# EAGLE design calc1 (EAGLE 5.10)

## Sheet 1 of 4
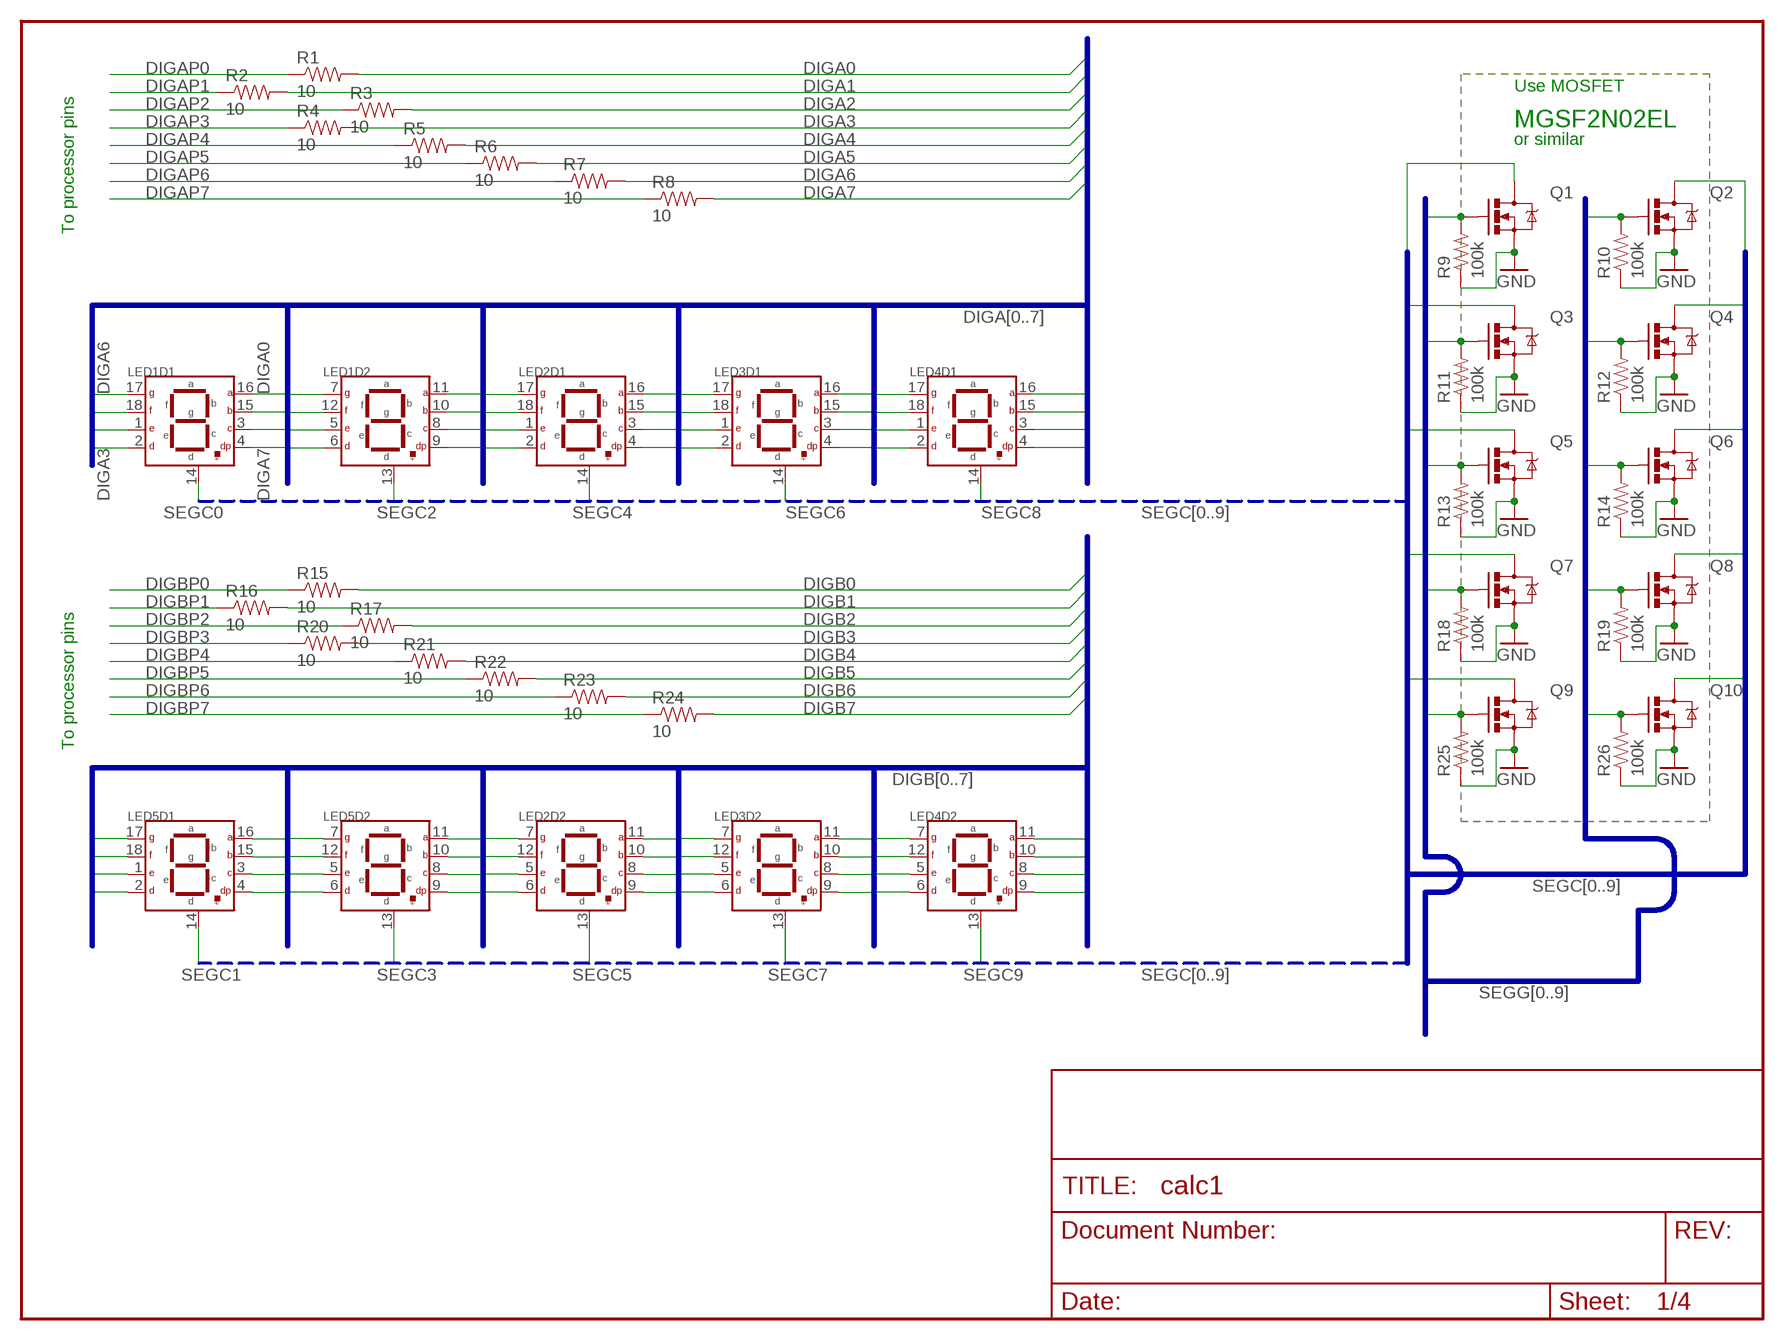
[diagram p0: schematic, sheet 1]

### Parts
LED1  2X7SEGMENT2X  [2X7SEG_PTH]
LED2  2X7SEGMENT2X  [2X7SEG_PTH]
LED3  2X7SEGMENT2X  [2X7SEG_PTH]
LED4  2X7SEGMENT2X  [2X7SEG_PTH]
LED5  2X7SEGMENT2X  [2X7SEG_PTH]
Q1  MOSFET-NCHANNELSMD  [SOT23-3]
Q2  MOSFET-NCHANNELSMD  [SOT23-3]
Q3  MOSFET-NCHANNELSMD  [SOT23-3]
Q4  MOSFET-NCHANNELSMD  [SOT23-3]
Q5  MOSFET-NCHANNELSMD  [SOT23-3]
Q6  MOSFET-NCHANNELSMD  [SOT23-3]
Q7  MOSFET-NCHANNELSMD  [SOT23-3]
Q8  MOSFET-NCHANNELSMD  [SOT23-3]
Q9  MOSFET-NCHANNELSMD  [SOT23-3]
Q10  MOSFET-NCHANNELSMD  [SOT23-3]
R1  10  RESISTOR  [0805]
R2  10  RESISTOR  [0805]
R3  10  RESISTOR  [0805]
R4  10  RESISTOR  [0805]
R5  10  RESISTOR  [0805]
R6  10  RESISTOR  [0805]
R7  10  RESISTOR  [0805]
R8  10  RESISTOR  [0805]
R9  100k  RESISTOR0603  [0603]
R10  100k  RESISTOR0603  [0603]
R11  100k  RESISTOR0603  [0603]
R12  100k  RESISTOR0603  [0603]
R13  100k  RESISTOR0603  [0603]
R14  100k  RESISTOR0603  [0603]
R15  10  RESISTOR  [0805]
R16  10  RESISTOR  [0805]
R17  10  RESISTOR  [0805]
R18  100k  RESISTOR0603  [0603]
R19  100k  RESISTOR0603  [0603]
R20  10  RESISTOR  [0805]
R21  10  RESISTOR  [0805]
R22  10  RESISTOR  [0805]
R23  10  RESISTOR  [0805]
R24  10  RESISTOR  [0805]
R25  100k  RESISTOR0603  [0603]
R26  100k  RESISTOR0603  [0603]

### Nets
DIGA0: LED1.11(D2:A) LED1.16(D1:A) LED2.16(D1:A) LED3.16(D1:A) LED4.16(D1:A) R1.2
DIGA1: LED1.10(D2:B) LED1.15(D1:B) LED2.15(D1:B) LED3.15(D1:B) LED4.15(D1:B) R2.2
DIGA2: LED1.3(D1:C) LED1.8(D2:C) LED2.3(D1:C) LED3.3(D1:C) LED4.3(D1:C) R3.2
DIGA3: LED1.2(D1:D) LED1.6(D2:D) LED2.2(D1:D) LED3.2(D1:D) LED4.2(D1:D) R4.2
DIGA4: LED1.1(D1:E) LED1.5(D2:E) LED2.1(D1:E) LED3.1(D1:E) LED4.1(D1:E) R5.2
DIGA5: LED1.12(D2:F) LED1.18(D1:F) LED2.18(D1:F) LED3.18(D1:F) LED4.18(D1:F) R6.2
DIGA6: LED1.7(D2:G) LED1.17(D1:G) LED2.17(D1:G) LED3.17(D1:G) LED4.17(D1:G) R7.2
DIGA7: LED1.4(D1:DP) LED1.9(D2:DP) LED2.4(D1:DP) LED3.4(D1:DP) LED4.4(D1:DP) R8.2
DIGAP0: R1.1 ; also sheet 2
DIGAP1: R2.1 ; also sheet 2
DIGAP2: R3.1 ; also sheet 2
DIGAP3: R4.1 ; also sheet 2
DIGAP4: R5.1 ; also sheet 2
DIGAP5: R6.1 ; also sheet 2
DIGAP6: R7.1 ; also sheet 2
DIGAP7: R8.1 ; also sheet 2
DIGB0: LED2.11(D2:A) LED3.11(D2:A) LED4.11(D2:A) LED5.11(D2:A) LED5.16(D1:A) R15.2
DIGB1: LED2.10(D2:B) LED3.10(D2:B) LED4.10(D2:B) LED5.10(D2:B) LED5.15(D1:B) R16.2
DIGB2: LED2.8(D2:C) LED3.8(D2:C) LED4.8(D2:C) LED5.3(D1:C) LED5.8(D2:C) R17.2
DIGB3: LED2.6(D2:D) LED3.6(D2:D) LED4.6(D2:D) LED5.2(D1:D) LED5.6(D2:D) R20.2
DIGB4: LED2.5(D2:E) LED3.5(D2:E) LED4.5(D2:E) LED5.1(D1:E) LED5.5(D2:E) R21.2
DIGB5: LED2.12(D2:F) LED3.12(D2:F) LED4.12(D2:F) LED5.12(D2:F) LED5.18(D1:F) R22.2
DIGB6: LED2.7(D2:G) LED3.7(D2:G) LED4.7(D2:G) LED5.7(D2:G) LED5.17(D1:G) R23.2
DIGB7: LED2.9(D2:DP) LED3.9(D2:DP) LED4.9(D2:DP) LED5.4(D1:DP) LED5.9(D2:DP) R24.2
DIGBP0: R15.1 ; also sheet 2
DIGBP1: R16.1 ; also sheet 2
DIGBP2: R17.1 ; also sheet 2
DIGBP3: R20.1 ; also sheet 2
DIGBP4: R21.1 ; also sheet 2
DIGBP5: R22.1 ; also sheet 2
DIGBP6: R23.1 ; also sheet 2
DIGBP7: R24.1 ; also sheet 2
GND: Q1.2(S) Q2.2(S) Q3.2(S) Q4.2(S) Q5.2(S) Q6.2(S) Q7.2(S) Q8.2(S) Q9.2(S) Q10.2(S) R9.1 R10.1 R11.1 R12.1 R13.1 R14.1 R18.1 R19.1 R25.1 R26.1 ; also sheet 2,3,4
SEGC0: LED1.14(D1:CC) Q1.3(D)
SEGC1: LED5.14(D1:CC) Q3.3(D)
SEGC2: LED1.13(D2:CC) Q5.3(D)
SEGC3: LED5.13(D2:CC) Q7.3(D)
SEGC4: LED2.14(D1:CC) Q9.3(D)
SEGC5: LED2.13(D2:CC) Q2.3(D)
SEGC6: LED3.14(D1:CC) Q4.3(D)
SEGC7: LED3.13(D2:CC) Q6.3(D)
SEGC8: LED4.14(D1:CC) Q8.3(D)
SEGC9: LED4.13(D2:CC) Q10.3(D)
SEGG0: Q1.1(G) R9.2 ; also sheet 2
SEGG1: Q3.1(G) R11.2 ; also sheet 2
SEGG2: Q5.1(G) R13.2 ; also sheet 2
SEGG3: Q7.1(G) R18.2 ; also sheet 2
SEGG4: Q9.1(G) R25.2 ; also sheet 2
SEGG5: Q2.1(G) R10.2 ; also sheet 2
SEGG6: Q4.1(G) R12.2 ; also sheet 2
SEGG7: Q6.1(G) R14.2 ; also sheet 2
SEGG8: Q8.1(G) R19.2 ; also sheet 2
SEGG9: Q10.1(G) R26.2 ; also sheet 2

### Buses
DIGA[0..7]
SEGC[0..9]
SEGG[0..9]
DIGB[0..7]

### Notes on the sheet
- Use MOSFET
- MGSF2N02EL
- or similar
- To processor pins
- To processor pins

## Sheet 2 of 4
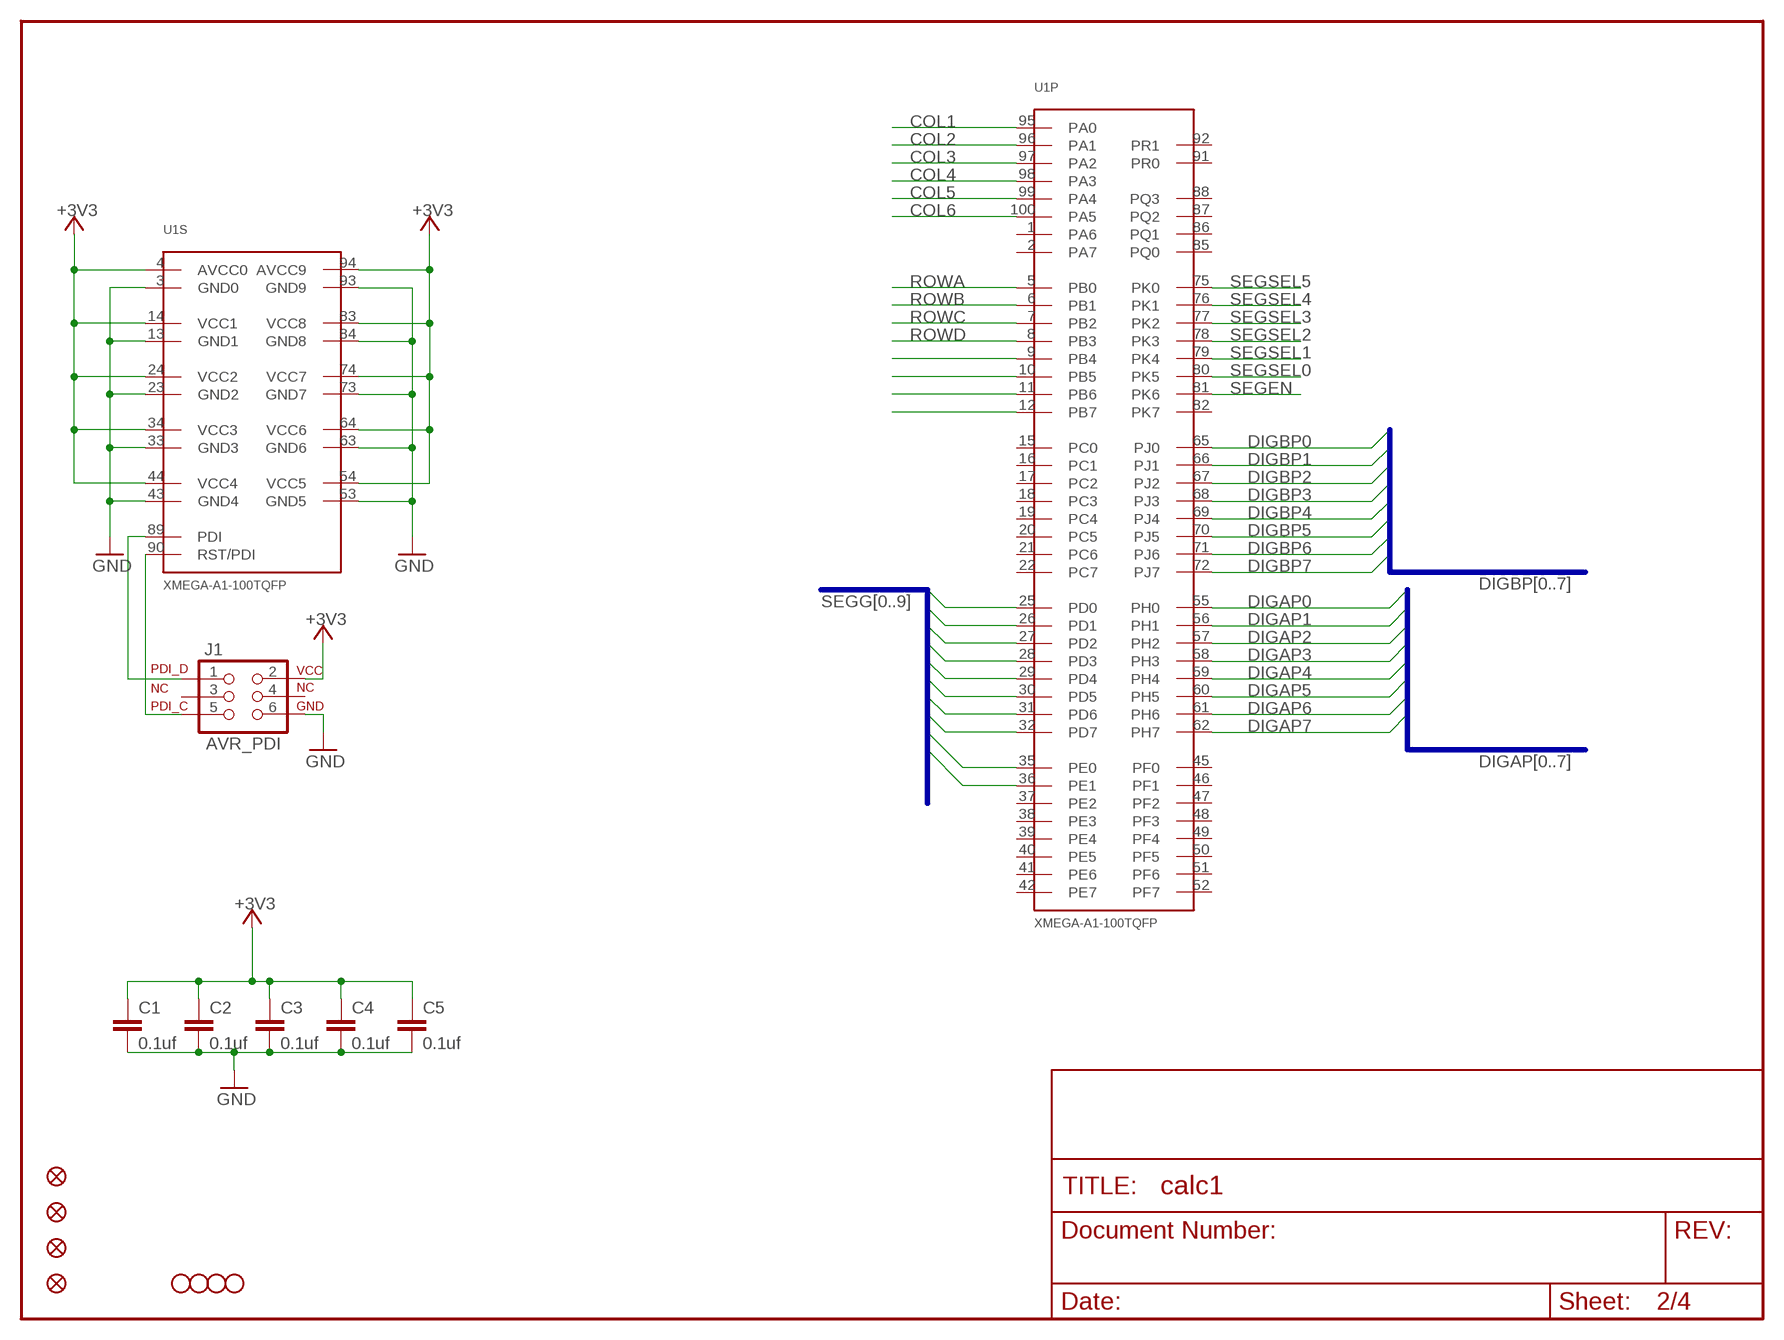
[diagram p1: schematic, sheet 2]

### Parts
$2_80_$  FIDUCIAL1.5X3  [FIDUCIAL-1.5X3]
$2_85_$  STAND-OFF  [STAND-OFF]
C1  0.1uf  CAP0603  [0603]
C2  0.1uf  CAP0603  [0603]
C3  0.1uf  CAP0603  [0603]
C4  0.1uf  CAP0603  [0603]
C5  0.1uf  CAP0603  [0603]
J1  AVR_PDI  [2X3]
U1  XMEGA-A1-100TQFP  [TQFP100]
U$2  FIDUCIAL1.5X3  [FIDUCIAL-1.5X3]
U$3  FIDUCIAL1.5X3  [FIDUCIAL-1.5X3]
U$4  FIDUCIAL1.5X3  [FIDUCIAL-1.5X3]
U$5  STAND-OFF  [STAND-OFF]
U$7  STAND-OFF  [STAND-OFF]
U$8  STAND-OFF  [STAND-OFF]

### Nets
+3V3: C1.1 C2.1 C3.1 C4.1 C5.1 J1.2 U1.4(S:AVCC0) U1.14(S:VCC1) U1.24(S:VCC2) U1.34(S:VCC3) U1.44(S:VCC4) U1.54(S:VCC5) U1.64(S:VCC6) U1.74(S:VCC7) U1.83(S:VCC8) U1.94(S:AVCC9) ; also sheet 3
COL1: U1.95(P:PA0) ; also sheet 4
COL2: U1.96(P:PA1) ; also sheet 4
COL3: U1.97(P:PA2) ; also sheet 4
COL4: U1.98(P:PA3) ; also sheet 4
COL5: U1.99(P:PA4) ; also sheet 4
COL6: U1.100(P:PA5) ; also sheet 4
DIGAP0: U1.55(P:PH0) ; also sheet 1
DIGAP1: U1.56(P:PH1) ; also sheet 1
DIGAP2: U1.57(P:PH2) ; also sheet 1
DIGAP3: U1.58(P:PH3) ; also sheet 1
DIGAP4: U1.59(P:PH4) ; also sheet 1
DIGAP5: U1.60(P:PH5) ; also sheet 1
DIGAP6: U1.61(P:PH6) ; also sheet 1
DIGAP7: U1.62(P:PH7) ; also sheet 1
DIGBP0: U1.65(P:PJ0) ; also sheet 1
DIGBP1: U1.66(P:PJ1) ; also sheet 1
DIGBP2: U1.67(P:PJ2) ; also sheet 1
DIGBP3: U1.68(P:PJ3) ; also sheet 1
DIGBP4: U1.69(P:PJ4) ; also sheet 1
DIGBP5: U1.70(P:PJ5) ; also sheet 1
DIGBP6: U1.71(P:PJ6) ; also sheet 1
DIGBP7: U1.72(P:PJ7) ; also sheet 1
GND: C1.2 C2.2 C3.2 C4.2 C5.2 J1.6 U1.3(S:GND0) U1.13(S:GND1) U1.23(S:GND2) U1.33(S:GND3) U1.43(S:GND4) U1.53(S:GND5) U1.63(S:GND6) U1.73(S:GND7) U1.84(S:GND8) U1.93(S:GND9) ; also sheet 1,3,4
N$1: J1.1 U1.89(S:PDI)
N$2: J1.5 U1.90(S:RST/PDI)
N$13: U1.9(P:PB4)
N$14: U1.10(P:PB5)
N$15: U1.11(P:PB6)
N$16: U1.12(P:PB7)
ROWA: U1.5(P:PB0) ; also sheet 4
ROWB: U1.6(P:PB1) ; also sheet 4
ROWC: U1.7(P:PB2) ; also sheet 4
ROWD: U1.8(P:PB3) ; also sheet 4
SEGEN: U1.81(P:PK6)
SEGG0: U1.25(P:PD0) ; also sheet 1
SEGG1: U1.26(P:PD1) ; also sheet 1
SEGG2: U1.27(P:PD2) ; also sheet 1
SEGG3: U1.28(P:PD3) ; also sheet 1
SEGG4: U1.29(P:PD4) ; also sheet 1
SEGG5: U1.30(P:PD5) ; also sheet 1
SEGG6: U1.31(P:PD6) ; also sheet 1
SEGG7: U1.32(P:PD7) ; also sheet 1
SEGG8: U1.35(P:PE0) ; also sheet 1
SEGG9: U1.36(P:PE1) ; also sheet 1
SEGSEL0: U1.80(P:PK5)
SEGSEL1: U1.79(P:PK4)
SEGSEL2: U1.78(P:PK3)
SEGSEL3: U1.77(P:PK2)
SEGSEL4: U1.76(P:PK1)
SEGSEL5: U1.75(P:PK0)
Unconnected: J1.3 J1.4 U1.1(P:PA6) U1.2(P:PA7) U1.15(P:PC0) U1.16(P:PC1) U1.17(P:PC2) U1.18(P:PC3) U1.19(P:PC4) U1.20(P:PC5) U1.21(P:PC6) U1.22(P:PC7) U1.37(P:PE2) U1.38(P:PE3) U1.39(P:PE4) U1.40(P:PE5) U1.41(P:PE6) U1.42(P:PE7) U1.45(P:PF0) U1.46(P:PF1) U1.47(P:PF2) U1.48(P:PF3) U1.49(P:PF4) U1.50(P:PF5) U1.51(P:PF6) U1.52(P:PF7) U1.82(P:PK7) U1.85(P:PQ0) U1.86(P:PQ1) U1.87(P:PQ2) U1.88(P:PQ3) U1.91(P:PR0) U1.92(P:PR1)

### Buses
DIGAP[0..7]
SEGG[0..9]
DIGBP[0..7]

## Sheet 3 of 4
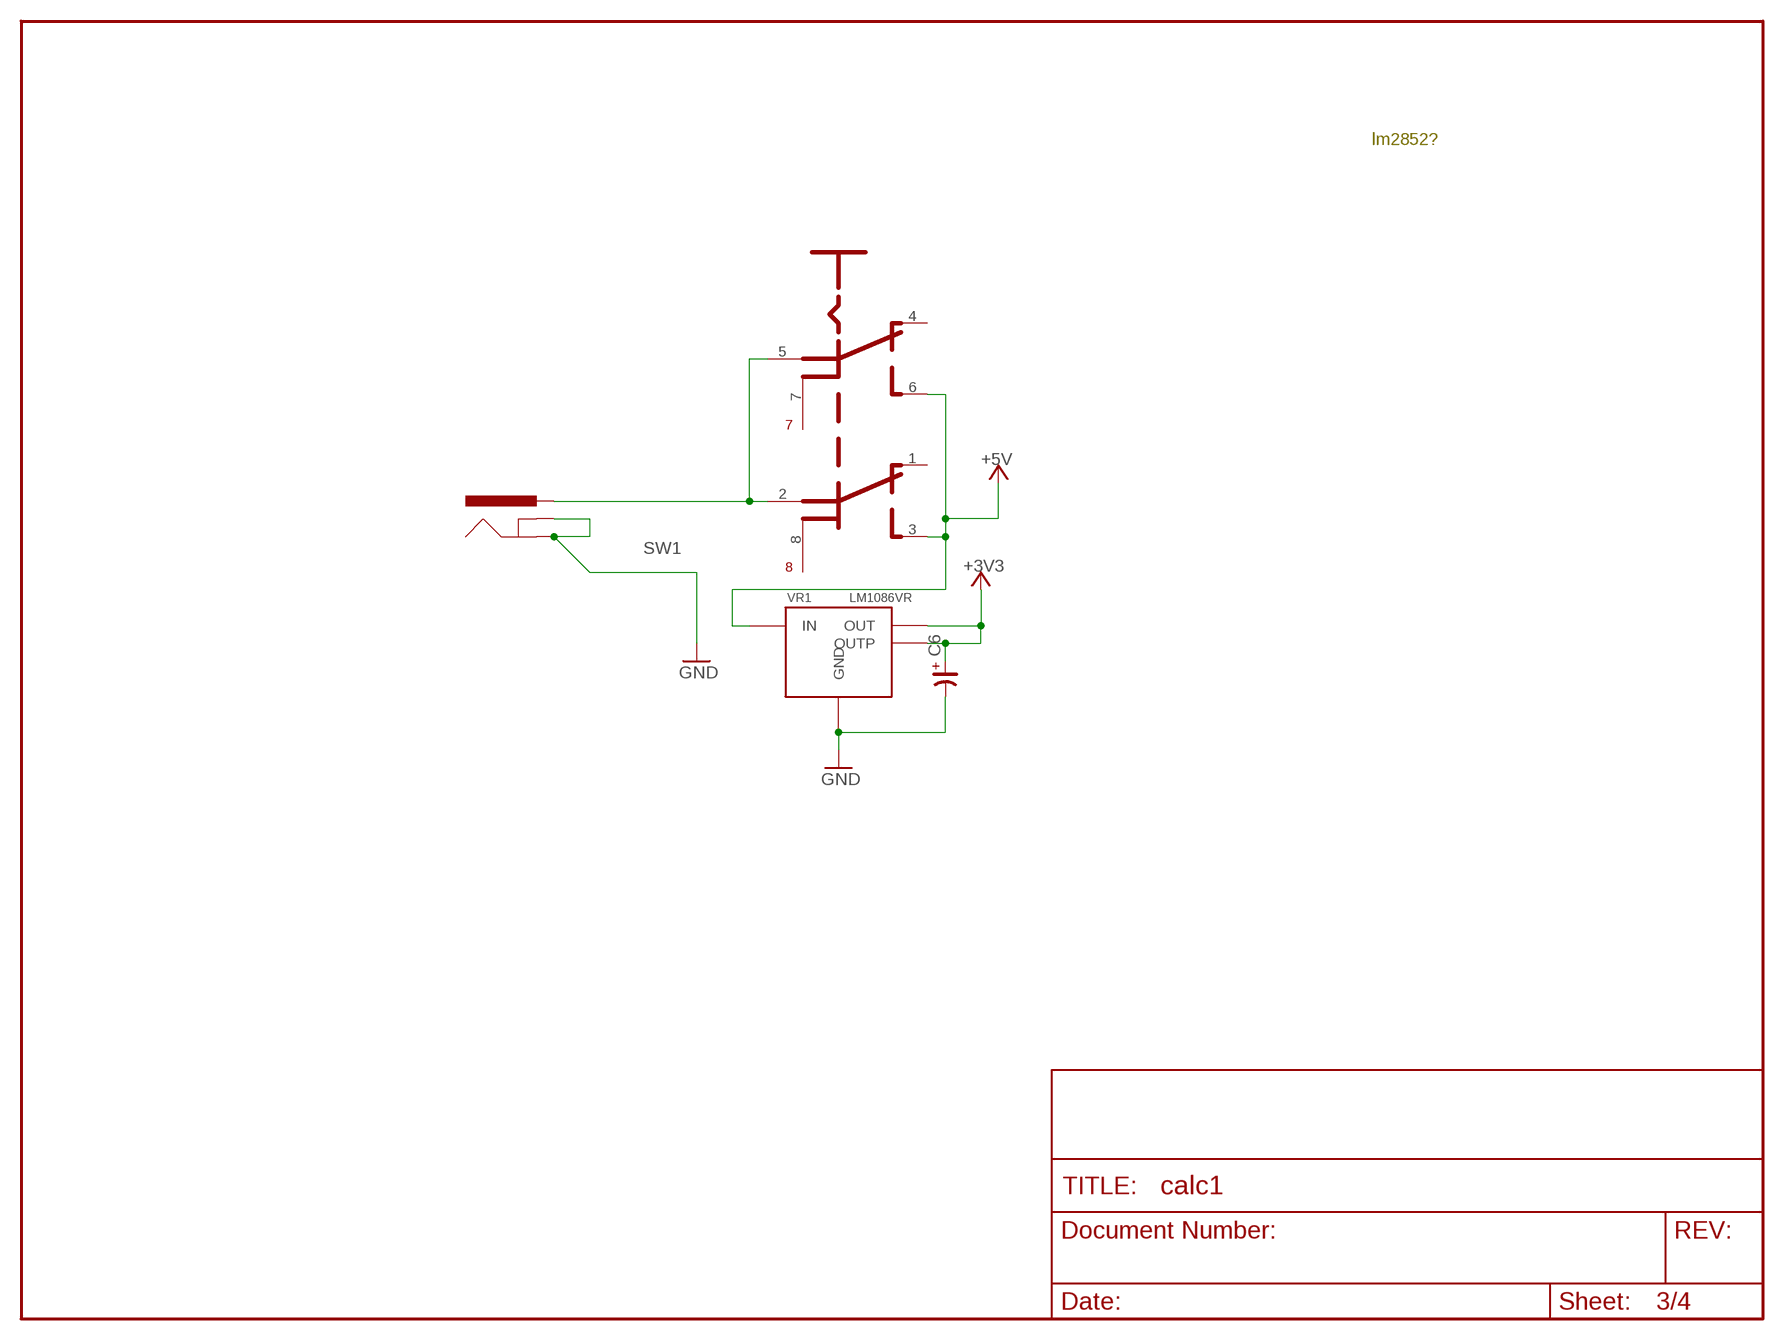
[diagram p2: schematic, sheet 3]

### Parts
C6  CP_SV-D  [CSV-D]
J2  POWER_JACKSLT  [POWER_JACK_SLOT]
SW1  EG2211A  [EG2211A]
VR1  LM1086VR  [TO263]

### Nets
+3V3: C6.+ VR1.2(OUT) VR1.TAB(OUTP) ; also sheet 2
+5V: SW1.3 SW1.6 VR1.3(IN)
GND: C6.- J2.GND@1(GNDBREAK) J2.GND@2(GND) VR1.1(GND) ; also sheet 1,2,4
N$26: J2.PWR SW1.2 SW1.5
Unconnected: SW1.1 SW1.4 SW1.7 SW1.8

### Notes on the sheet
- lm2852?

## Sheet 4 of 4
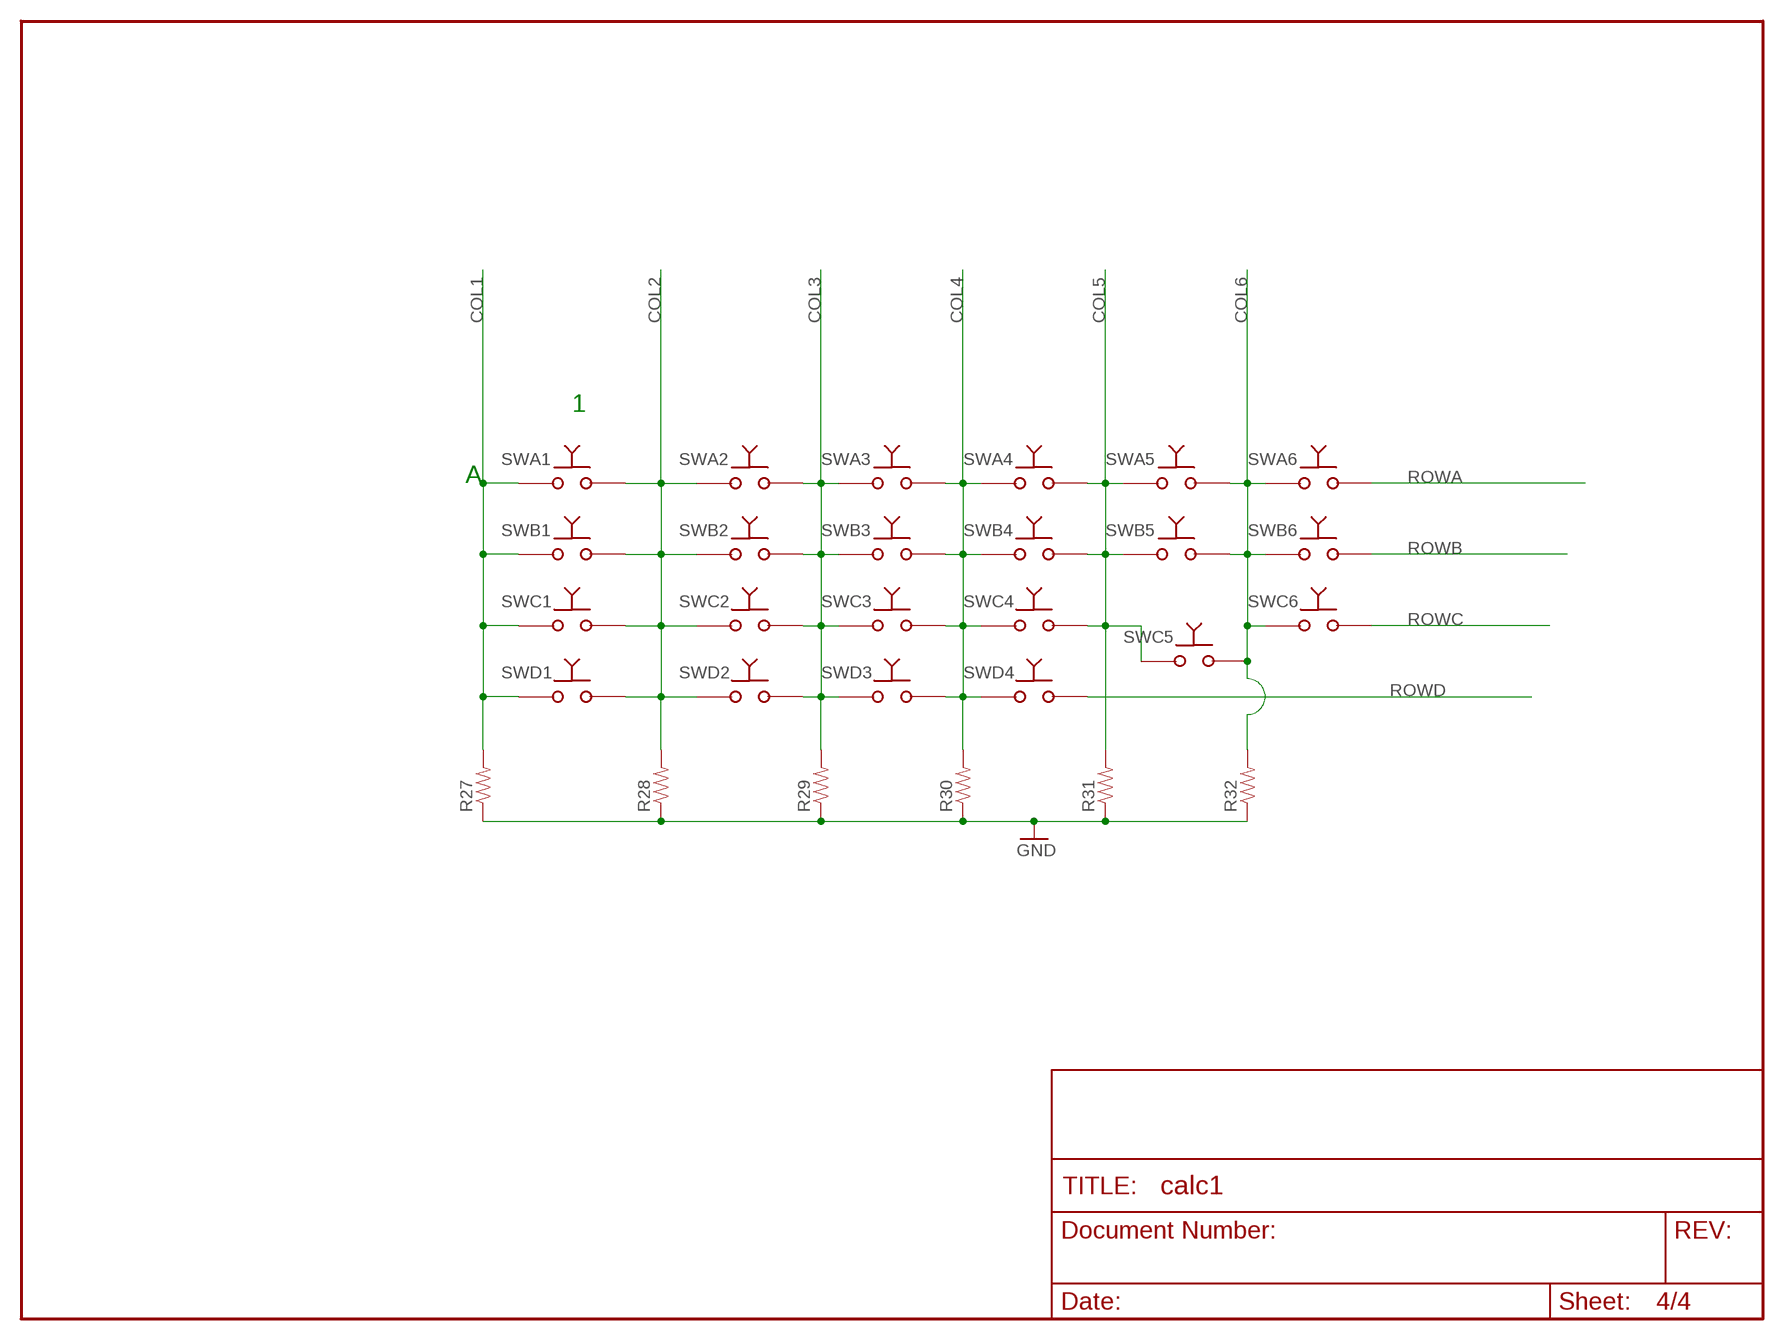
[diagram p3: schematic, sheet 4]

### Parts
R27  RESISTOR0603  [0603]
R28  RESISTOR0603  [0603]
R29  RESISTOR0603  [0603]
R30  RESISTOR0603  [0603]
R31  RESISTOR0603  [0603]
R32  RESISTOR0603  [0603]
SWA1  320E1-1  [320E1-1]
SWA2  320E1-1  [320E1-1]
SWA3  320E1-1  [320E1-1]
SWA4  320E1-1  [320E1-1]
SWA5  320E1-1  [320E1-1]
SWA6  320E1-1  [320E1-1]
SWB1  320E1-1  [320E1-1]
SWB2  320E1-1  [320E1-1]
SWB3  320E1-1  [320E1-1]
SWB4  320E1-1  [320E1-1]
SWB5  320E1-1  [320E1-1]
SWB6  320E1-1  [320E1-1]
SWC1  320E1-1  [320E1-1]
SWC2  320E1-1  [320E1-1]
SWC3  320E1-1  [320E1-1]
SWC4  320E1-1  [320E1-1]
SWC5  320E1-1  [320E1-1]
SWC6  320E1-1  [320E1-1]
SWD1  320E1-1  [320E1-1]
SWD2  320E1-1  [320E1-1]
SWD3  320E1-1  [320E1-1]
SWD4  320E1-1  [320E1-1]

### Nets
COL1: R27.2 SWA1.P$1 SWB1.P$1 SWC1.P$1 SWD1.P$1 ; also sheet 2
COL2: R28.2 SWA1.P$2 SWA2.P$1 SWB1.P$2 SWB2.P$1 SWC1.P$2 SWC2.P$1 SWD1.P$2 SWD2.P$1 ; also sheet 2
COL3: R29.2 SWA2.P$2 SWA3.P$1 SWB2.P$2 SWB3.P$1 SWC2.P$2 SWC3.P$1 SWD2.P$2 SWD3.P$1 ; also sheet 2
COL4: R30.2 SWA3.P$2 SWA4.P$1 SWB3.P$2 SWB4.P$1 SWC3.P$2 SWC4.P$1 SWD3.P$2 SWD4.P$1 ; also sheet 2
COL5: R31.2 SWA4.P$2 SWA5.P$1 SWB4.P$2 SWB5.P$1 SWC4.P$2 SWC5.P$1 ; also sheet 2
COL6: R32.2 SWA5.P$2 SWA6.P$1 SWB5.P$2 SWB6.P$1 SWC5.P$2 SWC6.P$1 ; also sheet 2
GND: R27.1 R28.1 R29.1 R30.1 R31.1 R32.1 ; also sheet 1,2,3
ROWA: SWA6.P$2 ; also sheet 2
ROWB: SWB6.P$2 ; also sheet 2
ROWC: SWC6.P$2 ; also sheet 2
ROWD: SWD4.P$2 ; also sheet 2

### Notes on the sheet
- 1
- A

## Library data of the parts
$2_80_$ U$2-U$4 = SparkFun:FIDUCIAL: Fiducial Alignment Points Various fiducial points for machine vision alignment.
$2_85_$ U$5 U$7 U$8 = SparkFun:STAND-OFF: Stand Off This is the mechanical footprint for a #4 phillips button head screw. Use the keepout ring to avoid running the screw head into surrounding components. SKU : PRT-00447
C1-C5 = SparkFun:CAP: Capacitor Standard 0603 ceramic capacitor, and 0.1" leaded capacitor.
C6 = rc-master-smd:CP_: POLARIZED CAP
J1 = con-headers:AVR_PDI
J2 = SparkFun:POWER_JACK: Power Jack This is the standard 5.5mm barrel jack for power. The PTH is the most common, proven, reliable, footprint. All others are experimental. The Slot footprint only works if the mill layer is transmitted to the PCB fab house so be warned. Spark Fun Electronics SKU : PRT-00119. Mating wall wart : TOL-00298 (and others)
LED1-LED5 = 7segment:2X7SEGMENT
Q1-Q10 = SparkFun:MOSFET-NCHANNEL
R1-R32 = SparkFun:RESISTOR: Resistor Basic schematic elements and footprints for 0603, 1206, and PTH 1/10th watt (small) resistors.
SW1 = Switch DPDT:EG2211A
SWA1-SWA6 SWB1-SWB6 SWC1-SWC6 SWD1-SWD4 = switch:320E1-1
U1 = atmel:XMEGA-A1-100: Atmel XMEGA 100 pin devices, A1 series Supply pins are on a different symbol.
VR1 = LM1086:LM1086

## Board
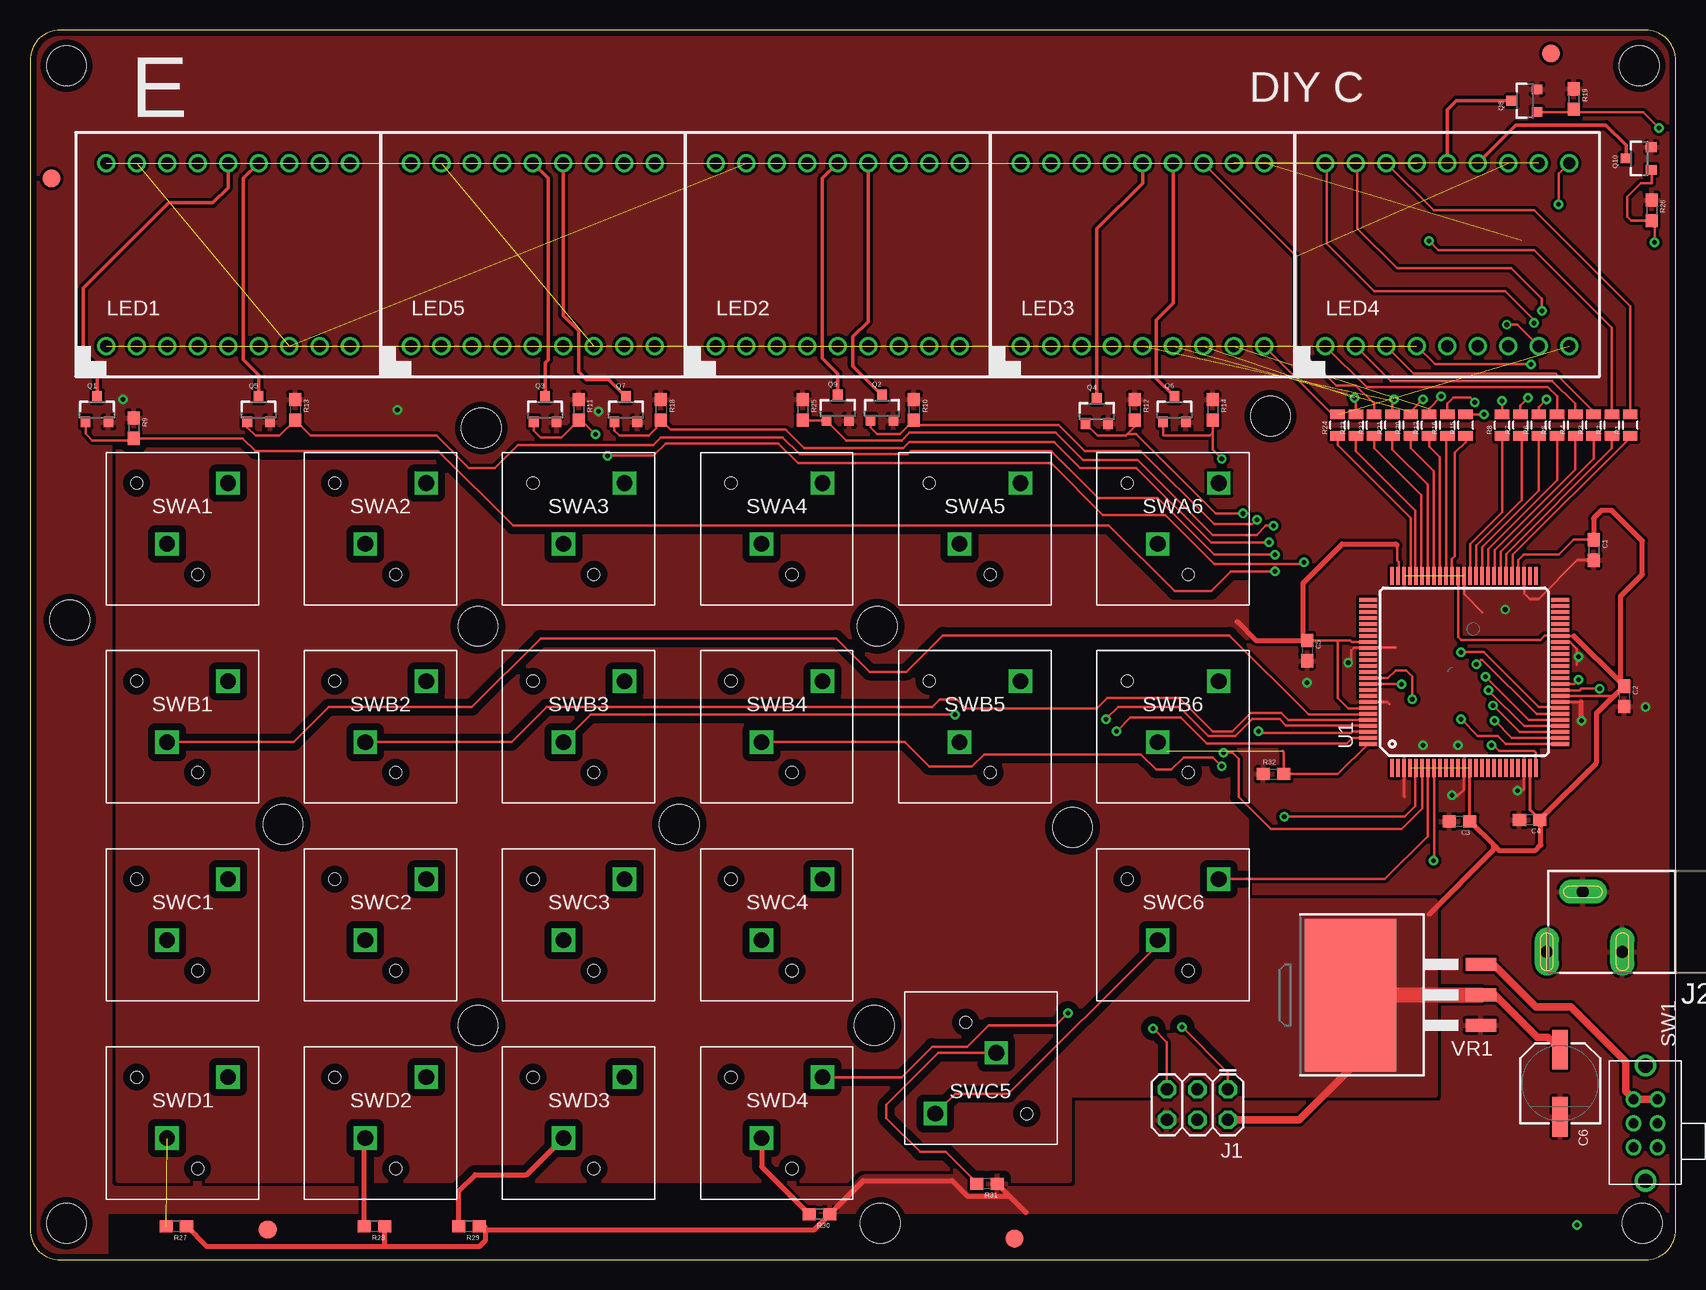
[diagram p4: board, top side]
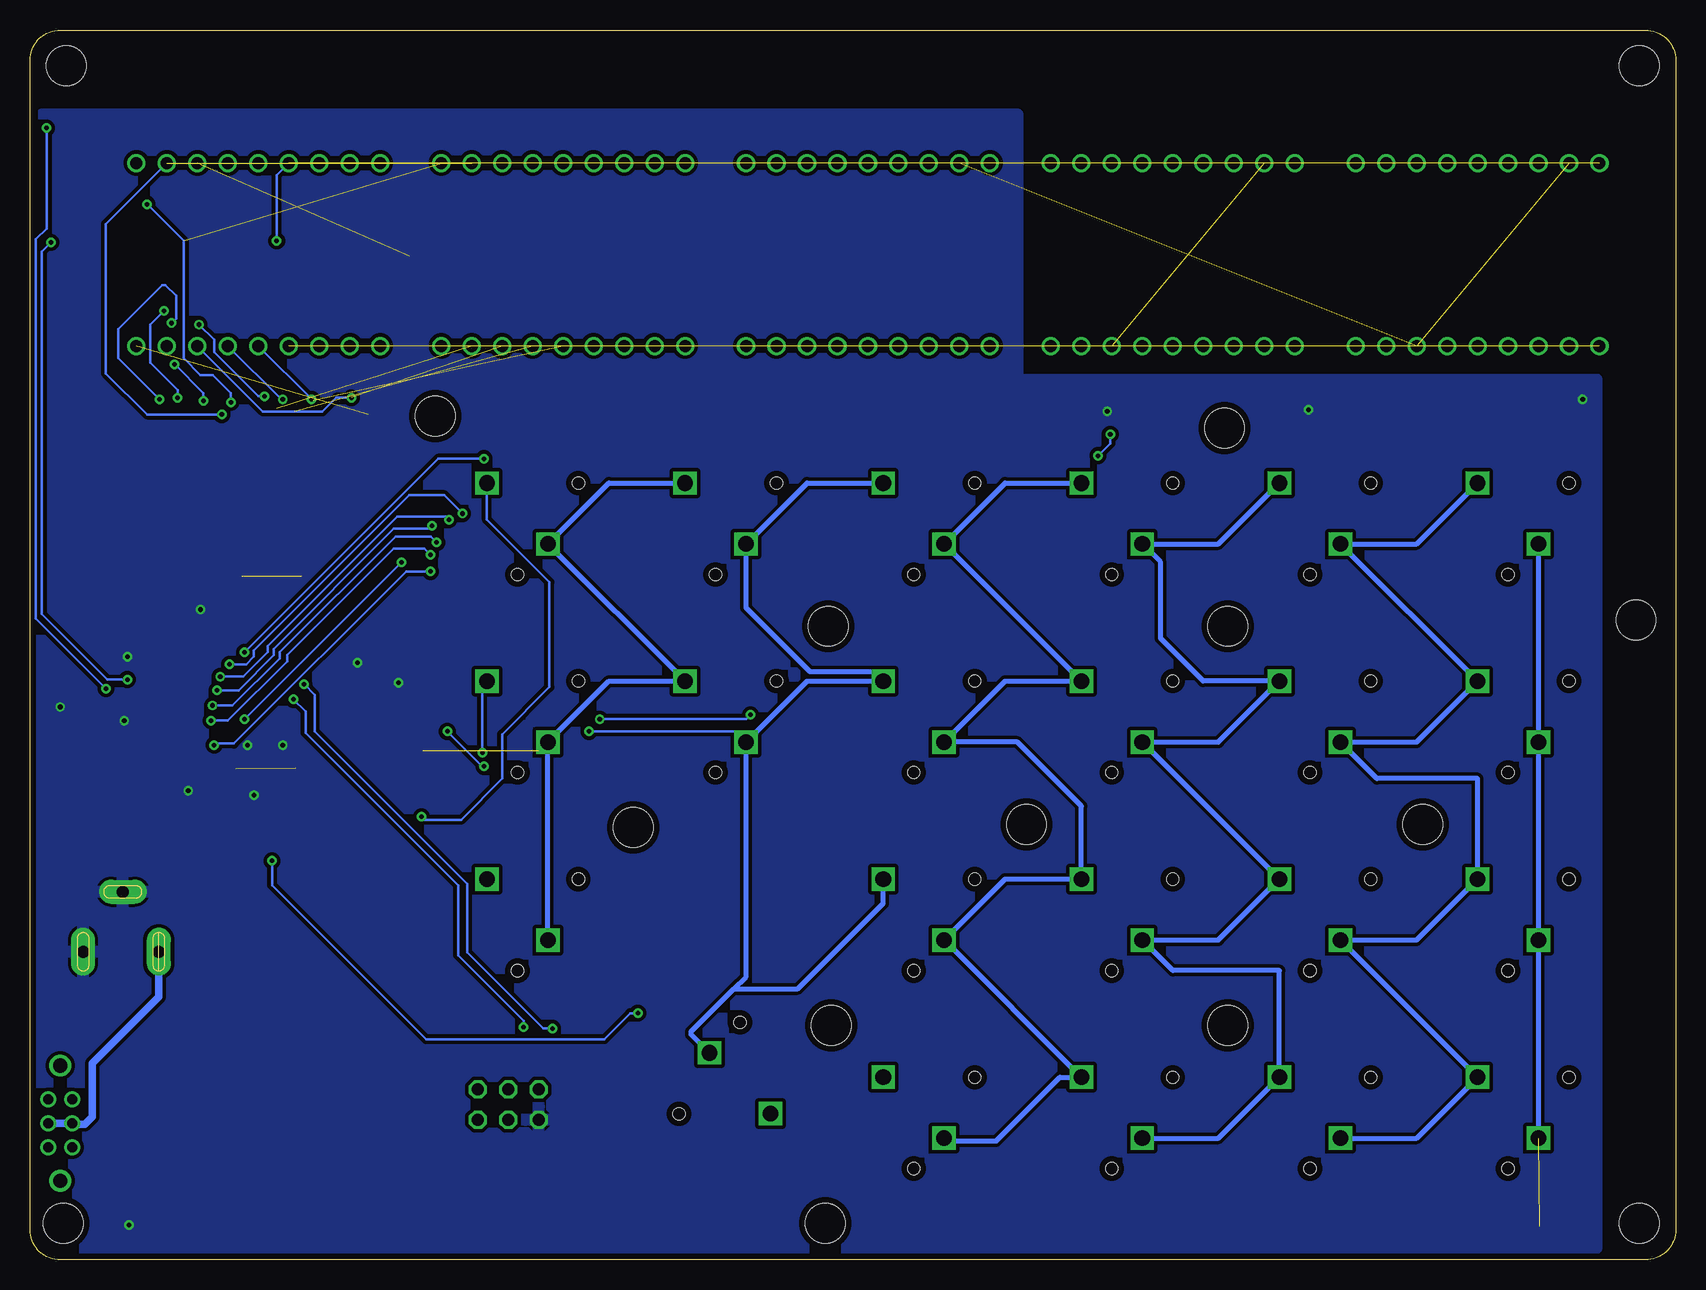
[diagram p5: board, bottom side, seen from below]

Size 137.14 x 102.54 mm. Coordinates in mm from the lower left corner, seen from the top.
Outline: 137.14,100 arc90 134.6,102.54 2.54,102.54 arc90 0,100 0,2.54 arc90 2.54,0 134.6,0 arc90 137.14,2.54 137.14,100
Copper layers (1*16): Top 0.035mm / dielectric 1.5mm / Bottom 0.035mm
Design rules "default *": minimum track width 8mil, minimum drill 15mil, track to track 7mil, track to pad 7mil, pad to pad 7mil, via to via 7mil, smd to smd 7mil, copper to edge 20mil, drill to drill 8mil, minimum pad ring 10mil, minimum via ring 8mil, stop-mask expansion 4mil, vias tented up to drill 15mil, thermal gap 10mil

### Footprints (pad centres in the part's own frame; a part is rotated, then mirrored left to right if it is on the bottom)
FIDUCIAL-1.5X3 = smd 1.5 x 1.5: 1 0,0
STAND-OFF = hole 3.302: 0,0
0603 = smd 1.1 x 1: 1 -0.85,0; 2 0.85,0
CSV-D = smd 3.302 x 1.27: + -2.794,0; - 2.794,0
2X3 = drill 1.016 octagon: 1 0,0; 2 0,2.54; 3 2.54,0; 4 2.54,2.54; 5 5.08,0; 6 5.08,2.54
POWER_JACK_SLOT = drill 1 pad 2 long: GND@1 2.58,7.5; GND@2 7.58,10.8; PWR 2.58,13.8
2X7SEG_PTH = drill 1 round: 1 -10.16,-7.62; 2 -7.62,-7.62; 3 -5.08,-7.62; 4 -2.54,-7.62; 5 0,-7.62; 6 2.54,-7.62; 7 5.08,-7.62; 8 7.62,-7.62; 9 10.16,-7.62; 10 10.16,7.62; 11 7.62,7.62; 12 5.08,7.62; 13 2.54,7.62; 14 0,7.62; 15 -2.54,7.62; 16 -5.08,7.62; 17 -7.62,7.62; 18 -10.16,7.62
SOT23-3 = smd 0.8 x 0.9: 1 -0.95,-1; 2 0.95,-1; 3 0,1.1
0805 = smd 0.8 x 1.2: 1 -0.9,0; 2 0.9,0
EG2211A = drill 0.813 round: 1 2.8,1; 2 4.8,1; 3 6.8,1; 4 2.8,-1; 5 4.8,-1; 6 6.8,-1 | drill 1.2 round: 7 0,0; 8 9.6,0
320E1-1 = drill 1.3 square: P$1 0,0; P$2 5.08,5.08 | hole 1: 2.54,-2.54; -2.54,5.08
TQFP100 = smd 1.5 x 0.3: 1 -8,6; 2 -8,5.5; 3 -8,5; 4 -8,4.5; 5 -8,4; 6 -8,3.5; 7 -8,3; 8 -8,2.5; 9 -8,2; 10 -8,1.5; 11 -8,1; 12 -8,0.5; 13 -8,0; 14 -8,-0.5; 15 -8,-1; 16 -8,-1.5; 17 -8,-2; 18 -8,-2.5; 19 -8,-3; 20 -8,-3.5; 21 -8,-4; 22 -8,-4.5; 23 -8,-5; 24 -8,-5.5; 25 -8,-6; 51 8,-6; 52 8,-5.5; 53 8,-5; 54 8,-4.5; 55 8,-4; 56 8,-3.5; 57 8,-3; 58 8,-2.5; 59 8,-2; 60 8,-1.5; 61 8,-1; 62 8,-0.5; 63 8,0; 64 8,0.5; 65 8,1; 66 8,1.5; 67 8,2; 68 8,2.5; 69 8,3; 70 8,3.5; 71 8,4; 72 8,4.5; 73 8,5; 74 8,5.5; 75 8,6 | smd 0.3 x 1.5: 26 -6,-8; 27 -5.5,-8; 28 -5,-8; 29 -4.5,-8; 30 -4,-8; 31 -3.5,-8; 32 -3,-8; 33 -2.5,-8; 34 -2,-8; 35 -1.5,-8; 36 -1,-8; 37 -0.5,-8; 38 0,-8; 39 0.5,-8; 40 1,-8; 41 1.5,-8; 42 2,-8; 43 2.5,-8; 44 3,-8; 45 3.5,-8; 46 4,-8; 47 4.5,-8; 48 5,-8; 49 5.5,-8; 50 6,-8; 76 6,8; 77 5.5,8; 78 5,8; 79 4.5,8; 80 4,8; 81 3.5,8; 82 3,8; 83 2.5,8; 84 2,8; 85 1.5,8; 86 1,8; 87 0.5,8; 88 0,8; 89 -0.5,8; 90 -1,8; 91 -1.5,8; 92 -2,8; 93 -2.5,8; 94 -3,8; 95 -3.5,8; 96 -4,8; 97 -4.5,8; 98 -5,8; 99 -5.5,8; 100 -6,8
TO263 = smd 1.067 x 2.54: 1 -2.54,-6.6; 2 0,-6.6; 3 2.54,-6.6 | smd 12.7 x 7.62: TAB 0,4.262

### Placement (x,y rotation side)
$2_80_$  1.78,90.17 0 top
$2_85_$  134.37,3.05 0 top
C1  130.3,59.18 270 top
C2  132.84,46.99 270 top
C3  119.13,36.58 180 top
C4  124.97,36.7 180 top
C5  106.43,50.8 270 top
C6  127.51,14.73 270 top
J1  99.82,14.22 180 top
J2  140.21,23.11 90 top
LED1  16.51,83.82 0 top
LED2  67.31,83.82 0 top
LED3  92.71,83.82 0 top
LED4  118.11,83.82 0 top
LED5  41.91,83.82 0 top
Q1  5.59,70.87 0 top
Q2  70.99,70.99 0 top
Q3  42.93,70.87 0 top
Q4  88.9,70.74 0 top
Q5  19.05,70.87 0 top
Q6  95.38,70.87 0 top
Q7  49.66,70.87 0 top
Q8  124.59,96.65 90 top
Q9  67.31,70.99 0 top
Q10  134.11,91.82 90 top
R1  133.35,69.6 90 top
R2  131.83,69.6 90 top
R3  130.3,69.6 90 top
R4  128.78,69.6 90 top
R5  127.25,69.6 90 top
R6  125.73,69.6 90 top
R7  124.21,69.6 90 top
R8  122.68,69.6 90 top
R9  8.64,69.34 270 top
R10  73.66,70.87 270 top
R11  45.72,70.87 270 top
R12  92.07,70.87 270 top
R13  22.1,70.87 270 top
R14  98.55,70.87 270 top
R15  119.63,69.6 90 top
R16  118.11,69.6 90 top
R17  116.59,69.6 90 top
R18  52.58,70.87 270 top
R19  128.65,96.77 270 top
R20  115.06,69.6 90 top
R21  113.54,69.6 90 top
R22  112.01,69.6 90 top
R23  110.49,69.6 90 top
R24  108.97,69.6 90 top
R25  64.39,70.87 270 top
R26  135.13,87.5 270 top
R27  12.19,2.79 180 top
R28  28.7,2.79 180 top
R29  36.58,2.79 180 top
R30  65.79,3.81 180 top
R31  79.76,6.35 180 top
R32  103.63,40.51 0 top
SW1  134.62,6.6 90 top
SWA1  11.43,59.69 0 top
SWA2  27.94,59.69 0 top
SWA3  44.45,59.69 0 top
SWA4  60.96,59.69 0 top
SWA5  77.47,59.69 0 top
SWA6  93.98,59.69 0 top
SWB1  11.43,43.18 0 top
SWB2  27.94,43.18 0 top
SWB3  44.45,43.18 0 top
SWB4  60.96,43.18 0 top
SWB5  77.47,43.18 0 top
SWB6  93.98,43.18 0 top
SWC1  11.43,26.67 0 top
SWC2  27.94,26.67 0 top
SWC3  44.45,26.67 0 top
SWC4  60.96,26.67 0 top
SWC5  80.52,17.27 180 top
SWC6  93.98,26.67 0 top
SWD1  11.43,10.16 0 top
SWD2  27.94,10.16 0 top
SWD3  44.45,10.16 0 top
SWD4  60.96,10.16 0 top
U1  119.51,49.02 90 top
U$1  STAND-OFF  [STAND-OFF]  37.34,19.56 0 top
U$2  126.75,100.58 0 top
U$3  82.04,1.78 0 top
U$4  19.81,2.54 0 top
U$5  3.3,53.34 0 top
U$6  STAND-OFF  [STAND-OFF]  3.05,3.05 0 top
U$7  3.05,99.57 0 top
U$8  134.11,99.57 0 top
U$10  STAND-OFF  [STAND-OFF]  70.87,3.05 0 top
U$11  STAND-OFF  [STAND-OFF]  54.1,36.32 0 top
U$12  STAND-OFF  [STAND-OFF]  21.08,36.32 0 top
U$13  STAND-OFF  [STAND-OFF]  70.61,52.83 0 top
U$15  STAND-OFF  [STAND-OFF]  103.38,70.36 0 top
U$16  STAND-OFF  [STAND-OFF]  37.59,69.34 0 top
U$17  STAND-OFF  [STAND-OFF]  86.87,36.07 0 top
U$18  STAND-OFF  [STAND-OFF]  37.34,52.83 0 top
U$19  STAND-OFF  [STAND-OFF]  70.36,19.56 0 top
VR1  114.3,22.1 90 top

### Tracks (layer width: path | path; a pad name or v marks a point on that pad's centre or on a via)
+3V3  (1 unrouted)
  Top 0.203: U1.54 124.01,58.35 124.46,58.8 127.38,58.8 128.65,60.07 130.26,60.07 C1.1 | 132.02,47.02 U1.34 | 128.66,52.02 U1.44 127.46,52.07 126.24,52.07 125.86,51.69 119.25,51.69 119.01,51.93 U1.64 | C5.1 108.97,51.65 | 108.97,51.65 110.02,51.65 110.15,51.52 U1.83 | 108.97,51.65 108.97,46.86 109.85,45.97 111.46,45.97 U1.94 | 113.92,59.56 113.92,58.29 114.05,58.17 114.05,57.06 U1.74
  Top 0.254: C3.1 119.98,40.99 U1.14 | U1.24 125.01,37.51 C4.1
  Top 0.406: 132.56,48.12 C2.1 132.02,47.02 131.99,47.02 130.56,45.59 130.56,41.44 125.91,36.79 | 132.56,48.12 128.66,52.02 | 125.91,36.79 C4.1 | 125.91,36.79 125.91,34.59 125.48,34.16 122.39,34.16 121.97,34.58 | 121.97,34.58 C3.1 | 106.09,51.65 102.15,51.65 100.58,53.21 | 106.09,51.65 C5.1 | 106.09,51.65 106.09,56.43 109.35,59.69 113.79,59.69 113.92,59.56 | 121.97,34.58 121.97,34.21 116.59,28.83 | 132.56,48.12 132.56,55.34 134.37,57.15 134.37,59.94 131.83,62.48 130.94,62.48 130.3,61.85 C1.1
  Top 0.61: VR1.2 122.05,22.1 125.6,18.54 126.49,18.54 C6.+ | J1.2 105.79,11.68 110.49,16.38 110.49,21.65 VR1.TAB
  Top 1.27: VR1.TAB VR1.2
  pour Top (isolate 0.61, no thermals): 115.06,13.72 86.61,13.72 86.61,6.6 7.37,6.6 7.37,69.09 101.35,69.09 101.35,29.97 117.09,29.97 117.09,13.72
+5V
  Top 0.61: VR1.3 121.92,24.64 125.48,21.08 128.4,21.08 132.97,16.51 132.97,14.05 SW1.3 SW1.6
COL1  (1 unrouted)
  Top 0.203: SWB1.P$1 21.97,43.18 24.89,46.1 36.83,46.1 42.55,51.82 67.18,51.82 69.98,49.02 73.02,49.02 76.07,52.07 99.95,52.07 106.55,45.47 111.45,45.47 U1.95
  Bottom 0.406: SWA1.P$1 SWB1.P$1 SWC1.P$1 SWD1.P$1
COL2
  Top 0.203: U1.96 104.84,45.02 104.27,45.59 101.73,45.59 100.2,44.07 98.55,44.07 95.76,46.86 89.79,46.86 88.9,45.97 77.98,45.97 77.22,46.74 75.82,46.74 75.18,46.1 43.05,46.1 40.13,43.18 SWB2.P$1
  Top 0.406: R28.2 27.85,10.07 SWD2.P$1
  Bottom 0.406: SWA1.P$2 21.59,59.69 SWA2.P$1 SWB1.P$2 21.59,43.18 SWB2.P$1 24.89,40.13 16.51,40.13 SWC1.P$2 21.59,26.67 SWC2.P$1 SWD1.P$2 21.59,10.16 SWD2.P$1
COL3  (via drill 0.38)
  Top 0.203: v89.66,45.09 90.68,46.1 95.76,46.1 98.17,43.69 100.46,43.69 101.85,45.09 104.14,45.09 104.65,44.58 111.45,44.58 U1.97 | v77.09,45.47 46.74,45.47 SWB3.P$1
  Top 0.406: R29.2 35.73,5.75 37.08,7.11 41.4,7.11 SWD3.P$1
  Bottom 0.203: v89.66,45.09 77.47,45.09 v77.09,45.47
  Bottom 0.406: SWD3.P$1 38.1,10.16 SWD2.P$2 33.02,24.13 41.91,24.13 SWC3.P$1 38.1,26.67 SWC2.P$2 SWB3.P$1 38.1,43.18 SWB2.P$2 39.37,48.26 42.93,51.82 42.93,58.17 SWA3.P$1 38.1,59.69 SWA2.P$2
COL4  (via drill 0.38)
  Top 0.203: SWB4.P$1 72.9,43.18 74.93,41.15 78.49,41.15 79.5,42.16 92.58,42.16 93.85,40.89 95.12,40.89 96.14,41.91 98.55,41.91 v99.31,41.15 | 102.41,44.02 v102.36,44.07 102.49,43.94 110.11,43.94 110.24,44.07 111.46,44.07 U1.98
  Top 0.406: SWD4.P$1 60.96,7.79 R30.2
  Bottom 0.203: v99.31,41.15 99.44,41.15 v102.36,44.07
  Bottom 0.406: SWA3.P$2 55.88,64.77 SWA4.P$1 SWB3.P$2 55.88,48.26 SWB4.P$1 54.86,43.18 49.53,37.85 SWC3.P$2 55.88,31.75 SWC4.P$1 SWD3.P$2 51.31,15.24 56.64,9.91 60.71,9.91 SWD4.P$1
COL5  (via drill 0.38)
  Top 0.203: v90.55,44.07 91.69,45.21 95.88,45.21 98.04,43.05 109.73,43.05 110.2,43.52 U1.99 | R31.2 78.91,6.44 76.33,9.02 74.17,9.02 71.37,11.81 71.37,12.95 75.69,17.27 SWC5.P$1
  Bottom 0.203: v90.55,44.07 78.36,44.07 SWB5.P$1
  Bottom 0.406: SWA4.P$2 72.39,64.77 SWA5.P$1 77.47,54.36 72.14,49.02 66.8,49.02 SWB4.P$2 72.39,48.26 SWB5.P$1 77.47,23.62 78.49,22.61 | SWC5.P$1 82.04,18.8 82.04,19.05 78.49,22.61 | SWC4.P$2 66.04,29.72 73.15,22.61 78.49,22.61
COL6  (1 unrouted)
  Top 0.203: U1.100 109,40.51 R32.2 104.48,42.33 104.39,42.42 | SWB6.P$1 94.74,42.42 | SWC6.P$1 93.98,26.29 81.53,13.84 77.09,13.84 SWC5.P$2
  Bottom 0.406: SWA5.P$2 88.9,64.77 SWA6.P$1 SWB5.P$2 88.9,48.26 SWB6.P$1 SWC6.P$1
DIGA0  (4 unrouted)
  Top 0.203: R1.2 133.35,79.5 125.35,87.5 116.97,87.5 LED4.16
DIGA1  (via drill 0.38)  (4 unrouted)
  Top 0.203: R2.2 131.83,77.72 125.35,84.2 117.35,84.2 v116.59,84.96
  Bottom 0.203: v116.59,84.96 116.59,90.42 LED4.15
DIGA2  (4 unrouted)
  Top 0.203: R3.2 130.3,70.74 127.13,73.91 115.32,73.91 LED4.3
DIGA3  (4 unrouted)
  Top 0.203: R4.2 128.78,71.37 126.87,73.28 113.41,73.28 LED4.2
DIGA4  (4 unrouted)
  Top 0.203: R5.2 127.25,72.01 126.49,72.77 111.38,72.77 LED4.1
DIGA5  (via drill 0.38)  (4 unrouted)
  Top 0.203: R6.2 125.73,71.12 v126.36,71.75 | v125.35,78.1 125.35,78.36 122.94,80.77 112.01,80.77 108.08,84.71 108.08,91.31 LED4.18
  Bottom 0.203: v126.36,71.75 129.79,75.18 129.79,77.6 126.11,81.28 125.86,81.28 124.97,80.39 124.97,78.49 v125.35,78.1
DIGA6  (via drill 0.38)  (4 unrouted)
  Top 0.203: R7.2 124.21,71.25 v124.84,71.88 | v125.98,79.12 125.98,80.14 123.44,82.68 113.92,82.68 110.62,85.98 110.62,91.31 LED4.17
  Bottom 0.203: v124.84,71.88 124.84,72.52 127.13,74.8 127.13,77.98 v125.98,79.12
DIGA7  (via drill 0.38)  (4 unrouted)
  Top 0.203: R8.2 v122.68,71.63 | v125.09,74.68 117.09,74.68 LED4.4
  Bottom 0.203: v125.09,74.68 122.68,72.26 v122.68,71.63
DIGAP0
  Top 0.203: U1.55 123.57,57.09 123.57,58.8 133.35,68.58 R1.1
DIGAP1
  Top 0.203: 131.95,68.57 R2.1 131.83,67.69 123.01,58.87 U1.56
DIGAP2
  Top 0.203: R3.1 130.3,66.8 122.55,59.05 122.55,57.07 U1.57
DIGAP3
  Top 0.203: R4.1 128.78,65.91 122.05,59.18 122.05,57.06 U1.58
DIGAP4
  Top 0.203: U1.59 121.51,59.28 127.25,65.02 R5.1
DIGAP5
  Top 0.203: R6.1 125.73,64.13 121.03,59.44 121.03,57.05 U1.60
DIGAP6
  Top 0.203: U1.61 120.51,59.55 124.33,63.37 124.33,68.57 R7.1
DIGAP7
  Top 0.203: R8.1 122.68,62.36 120.02,59.69 U1.62
DIGB0  (via drill 0.38)  (4 unrouted)
  Top 0.203: R15.2 120.66,70.5 v121.16,70.49
  Bottom 0.203: v121.16,70.49 127.38,70.49 130.81,73.91 130.81,86.36 LED4.11
DIGB1  (via drill 0.38)  (4 unrouted)
  Top 0.203: R16.2 118.11,71.37 118.62,71.88 120.02,71.88 v120.4,71.5 | v127.38,88.01 127.38,90.55 LED4.10
  Bottom 0.203: v120.4,71.5 120.4,72.26 121.92,73.79 122.94,73.79 124.33,75.18 124.33,84.96 v127.38,88.01
DIGB2  (via drill 0.38)  (4 unrouted)
  Top 0.203: R17.2 116.59,70.99 v117.6,72.01 | v123.06,77.98 123.95,77.98 LED4.8
  Bottom 0.203: v117.6,72.01 118.11,72.01 121.79,75.69 121.79,76.71 v123.06,77.98
DIGB3  (via drill 0.38)  (4 unrouted)
  Top 0.203: R20.2 115.06,70.74 v116.08,71.75
  Bottom 0.203: v116.08,71.75 116.2,71.75 LED4.6
DIGB4  (via drill 0.38)  (4 unrouted)
  Top 0.203: R21.2 113.54,71.63 v113.67,71.75
  Bottom 0.203: v113.67,71.75 LED4.5
DIGB5  (4 unrouted)
  Top 0.203: R22.2 112.01,71.37 110.49,72.9 108.84,72.9 105.54,76.2 105.54,83.69 LED3.12
DIGB6  (via drill 0.38)  (4 unrouted)
  Top 0.203: R23.2 110.49,71.75 v110.36,71.88
  Bottom 0.203: v110.36,71.88 111.63,71.88 112.78,70.74 117.73,70.74 LED4.7
DIGB7  (4 unrouted)
  Top 0.203: R24.2 108.57,70.5 LED3.9
DIGBP0
  Top 0.203: R15.1 119.63,68.2 118.74,67.31 118.74,58.67 118.49,58.42 118.49,57.04 U1.65
DIGBP1
  Top 0.203: U1.66 118.01,68.59 R16.1
DIGBP2
  Top 0.203: R17.1 116.59,67.82 117.48,66.93 117.48,57.05 U1.67
DIGBP3
  Top 0.203: R20.1 115.06,67.69 116.97,65.79 116.97,57.06 U1.68
DIGBP4
  Top 0.203: R21.1 113.54,67.56 116.46,64.64 116.46,57.07 U1.69
DIGBP5
  Top 0.203: R22.1 112.01,67.69 115.95,63.75 115.95,57.08 U1.70
DIGBP6
  Top 0.203: R23.1 110.49,67.44 115.44,62.48 115.44,57.09 U1.71
DIGBP7
  Top 0.203: R24.1 108.97,67.94 115.06,61.85 115.06,57.08 U1.72
GND  (via drill 0.38)  (1 unrouted)
  Top 0.203: C2.2 132.46,46.52 | U1.33 129.25,46.52 | C1.2 128.94,58.33 125.73,55.12 124.97,55.12 124.51,55.58 U1.53 | U1.63 119.51,55.5 121.03,53.98 | U1.43 128.31,51.52 128.91,50.93 128.91,49.66 v129.03,50.29 | U1.93 113.12,46.52 113.28,46.35 | 113.79,51.05 111.47,51.05 110.36,51.05 110.11,50.8 110.11,50.04 v109.85,49.78
  Top 0.254: U1.23 124.51,39.29 124.33,39.12 v123.95,39.12 | U1.13 119.51,39.24 119,38.73 v118.49,38.73 | U1.3 114.51,38.66 114.55,38.61 | 111.47,51.05 U1.84
  Top 0.406: 81.64,5.31 R31.1 | 81.64,5.31 83.02,3.94 | 81.64,5.31 78.12,5.31 76.83,6.6 69.43,6.6 R30.1 65.37,2.54 37.97,2.54 | R27.1 14.69,1.14 29.46,1.14 | 29.46,1.14 29.55,1.23 R28.1 | 29.46,1.14 37.47,1.14 37.97,1.65 37.97,2.54 | 37.97,2.54 37.97,2.67 37.85,2.79 R29.1 | 129.25,46.52 129.25,45 v129.29,44.96
  other vias: 128.91,2.92 122.94,54.23 134.62,46.1 119,42.93 106.43,48.13 116.08,42.93 47.37,70.74 30.61,70.87 7.75,71.75
  pour Bottom (isolate 0.305): 6.6,73.41 6.6,1.02 136.14,1.02 136.14,95.5 54.86,95.5 54.86,73.41
  pour Top (isolate 0.254, rank 2): 6.35,4.06 137.41,4.06 137.41,102.62 -3.3,102.62 -3.3,20.32 -3.3,-2.54 6.35,-2.54
N$1  (via drill 0.38)
  Top 0.203: J1.1 99.82,15.62 v96.01,19.43 | v115.19,46.74 115.19,48.64 114.68,49.15 113.79,49.15 113.16,48.51 U1.89
  Bottom 0.203: v96.01,19.43 96.01,19.94 101.47,25.4 101.47,31.24 114.17,43.94 114.17,45.72 v115.19,46.74
N$2  (via drill 0.38)
  Top 0.203: J1.5 94.74,18.16 v93.6,19.3 | v114.3,48.01 111.52,48.01 U1.90
  Bottom 0.203: v93.6,19.3 94.36,19.3 100.71,25.65 100.71,31.37 113.41,44.07 113.41,47.12 v114.3,48.01
N$26
  Bottom 0.61: J2.PWR 126.41,21.93 131.95,16.38 131.95,11.94 132.59,11.3 133.52,11.3 SW1.2 SW1.5
ROWA  (via drill 0.38)
  Top 0.203: v104.52,36.96 114.55,36.96 115.44,37.85 115.44,40.96 U1.5
  Bottom 0.203: SWA6.P$2 99.06,61.72 93.85,56.51 93.85,47.75 97.79,43.82 97.79,40.13 101.22,36.7 104.27,36.7 v104.52,36.96
ROWB  (via drill 0.38)
  Top 0.203: U1.6 116.01,37.65 114.3,35.94 103.38,35.94 100.71,38.61 100.71,41.78 100.2,42.29 v99.44,42.29
  Bottom 0.203: SWB6.P$2 99.57,47.75 99.44,47.62 v99.44,42.29
ROWC
  Top 0.203: SWC6.P$2 112.9,31.75 116.46,35.31 116.46,40.97 U1.7
ROWD  (via drill 0.38)
  Top 0.203: SWD4.P$2 72.64,15.24 75.18,17.78 78.1,17.78 79.88,19.56 85.47,19.56 v86.49,20.57 | 117.09,33.4 v116.97,33.27 117.01,33.31 U1.8
  Bottom 0.203: v86.49,20.57 87.12,20.57 89.28,18.41 104.14,18.41 116.97,31.24 v116.97,33.27
SEGC0
  Top 0.305: Q1.3 5.59,74.29 4.44,75.44 4.44,81.03 11.56,88.14 15.24,88.14 16.51,89.41 LED1.14
SEGC1
  Top 0.305: Q3.3 42.93,74.8 43.18,75.06 43.18,90.17 LED5.14
SEGC2
  Top 0.305: Q5.3 19.05,73.79 17.78,75.06 17.78,90.17 LED1.13
SEGC3
  Top 0.305: LED5.13 44.45,78.74 45.72,77.47 45.72,74.04 46.36,73.41 48.22,73.41 Q7.3
SEGC4
  Top 0.305: Q9.3 67.31,73.91 66.04,75.18 66.04,90.17 LED2.14
SEGC5
  Top 0.305: LED2.13 69.85,78.23 68.58,76.96 68.58,74.51 Q2.3
SEGC6
  Top 0.305: Q4.3 88.9,85.98 92.71,89.79 LED3.14
SEGC7
  Top 0.305: LED3.13 95.25,79.76 93.85,78.36 93.85,73.49 Q6.3
SEGC8
  Top 0.305: Q8.3 118.87,96.65 118.11,95.88 LED4.14
SEGC9
  Top 0.305: Q10.3 133.01,92.92 131.32,94.62 123.83,94.62 LED4.13
SEGG0  (via drill 0.38)
  Top 0.203: Q1.1 4.64,68.9 5.21,68.33 8.47,68.33 R9.2 17.74,68.49 18.8,67.44 34.04,67.44 40.26,61.21 89.92,61.21 95.38,55.75 98.42,55.75 100.08,57.4 v103.76,57.4 | v121.79,42.93 121.92,42.93 122.43,42.42 125.35,42.42 125.48,42.29 125.48,41.05 U1.25
  Bottom 0.203: v103.76,57.4 105.79,57.4 120.14,43.05 121.67,43.05 v121.79,42.93
SEGG1  (via drill 0.38)
  Top 0.203: Q3.1 41.98,69.15 42.55,68.58 44.28,68.58 R11.2 45.94,70.02 v47.12,68.83 | U1.26 122.97,43.02 122.3,43.69 120.65,43.69 v119.25,45.09 | v48.13,67.06 51.94,67.06 52.96,68.07 62.36,68.07 64.01,66.42 85.09,66.42 89.41,62.1 94.61,62.1 98.68,58.04 106.05,58.04 v106.17,58.17
  Bottom 0.203: v106.17,58.17 v119.25,45.09 | v47.12,68.83 47.12,68.07 v48.13,67.06
SEGG2  (via drill 0.38)
  Top 0.203: Q5.1 18.1,69.4 18.8,68.71 20.79,68.71 R13.2 23.41,68.71 33.91,68.71 36.58,66.04 38.73,66.04 40.64,67.94 51.94,67.94 52.58,68.58 62.74,68.58 64.13,67.18 73.15,67.18 73.41,67.44 85.09,67.44 89.03,63.5 93.98,63.5 98.68,58.8 v103.76,58.8 | U1.27 123.48,43.52 v122.05,44.96
  Bottom 0.203: v122.05,44.96 120.65,44.96 115.7,49.91 115.7,50.42 106.81,59.31 104.27,59.31 v103.76,58.8
SEGG3  (via drill 0.38)
  Top 0.203: Q7.1 48.71,69.15 49.15,68.71 51.56,68.71 52.2,69.34 52.2,69.63 R18.2 53.38,69.22 62.99,69.22 64.52,67.69 72.77,67.69 73.28,68.2 85.34,68.2 87.5,66.04 92.2,66.04 98.42,59.82 v103.25,59.82 | U1.28 124.13,44.02 v121.92,46.23
  Bottom 0.203: v121.92,46.23 120.27,46.23 116.33,50.16 116.33,50.67 106.68,60.32 103.76,60.32 v103.25,59.82
SEGG4  (via drill 0.38)
  Top 0.203: R25.2 64.41,69.99 Q9.1 68.03,68.33 72.64,68.33 73.28,68.96 85.47,68.96 87.76,66.68 92.33,66.68 98.55,60.45 102.23,60.45 103,61.21 v103.63,61.21 | U1.29 124.52,44.52 v121.54,47.5
  Bottom 0.203: v121.54,47.5 119.76,47.5 116.84,50.42 116.84,50.93 106.81,60.96 103.89,60.96 v103.63,61.21
SEGG5  (via drill 0.38)
  Top 0.203: Q2.1 70.04,69.4 70.61,68.83 72.48,68.83 R10.2 74.08,69.6 85.72,69.6 87.88,67.44 92.58,67.44 98.68,61.34 101.85,61.34 v102.23,61.72 101.98,61.47 | U1.30 124.9,45.02 v121.28,48.64
  Bottom 0.203: v121.28,48.64 119.38,48.64 117.35,50.67 117.35,51.18 106.55,61.98 102.49,61.98 v102.23,61.72
SEGG6  (via drill 0.38)
  Top 0.203: R12.2 92.07,69.47 91.44,68.83 | 91.44,68.83 91.31,68.71 88.98,68.71 Q4.1 | U1.31 125.55,45.52 121.03,50.04 120.9,50.04 v120.52,49.66 | 91.44,68.83 92.2,68.83 98.81,62.23 v101.09,62.23
  Bottom 0.203: v120.52,49.66 119.13,49.66 118.49,50.29 118.49,50.8 105.54,63.75 102.62,63.75 v101.09,62.23
SEGG7  (via drill 0.38)
  Top 0.203: Q6.1 94.43,68.77 94.49,68.71 98.3,68.71 98.55,68.96 R14.2 98.55,67.56 v99.31,66.8 | U1.32 127.43,46.1 125.73,46.1 121.16,50.67 v119.25,50.67
  Bottom 0.203: v119.25,50.67 103.12,66.8 v99.31,66.8
SEGG8  (via drill 0.38)
  Top 0.203: Q8.1 128.42,95.7 | 128.42,95.7 R19.2 | 128.42,95.7 134.43,95.7 v135.76,94.36 | v130.81,47.62 129.29,47.62 129.16,47.5 127.53,47.5 U1.35
  Bottom 0.203: v135.76,94.36 135.76,85.98 136.65,85.09 136.65,53.47 v130.81,47.62
SEGG9  (via drill 0.38)
  Top 0.203: U1.36 128.67,48.02 v129.03,48.39 | v135.38,84.84 135.38,86.4 R26.2 133.44,86.65 133.1,87 133.1,88.65 134.24,89.79 135.13,89.79 135.13,90.85 Q10.1
  Bottom 0.203: v135.38,84.84 136.14,84.07 136.14,53.85 130.68,48.39 v129.03,48.39

### Text on the board
tNames: DIY C | E